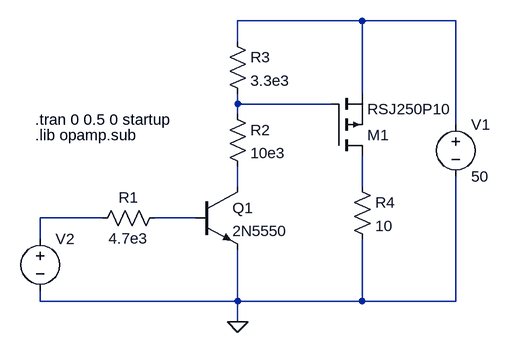
[diagram p0: schematic pmos-driver.asc]
pmos-driver.asc, the LTspice schematic file:
Version 4
SHEET 1 2184 680
WIRE -208 -688 -400 -688
WIRE -64 -688 -208 -688
WIRE -400 -656 -400 -688
WIRE -208 -576 -208 -688
WIRE -400 -560 -400 -576
WIRE -256 -560 -400 -560
WIRE -400 -544 -400 -560
WIRE -64 -528 -64 -688
WIRE -400 -432 -400 -464
WIRE -208 -432 -208 -480
WIRE -608 -384 -704 -384
WIRE -464 -384 -528 -384
WIRE -704 -352 -704 -384
WIRE -704 -256 -704 -272
WIRE -400 -256 -400 -336
WIRE -400 -256 -704 -256
WIRE -208 -256 -208 -352
WIRE -208 -256 -400 -256
WIRE -64 -256 -64 -448
WIRE -64 -256 -208 -256
WIRE -400 -224 -400 -256
FLAG -400 -224 0
SYMBOL pmos -256 -480 M180
SYMATTR InstName M1
SYMATTR Value RSJ250P10
SYMBOL res -512 -400 R90
WINDOW 0 0 56 VBottom 2
WINDOW 3 32 56 VTop 2
SYMATTR InstName R1
SYMATTR Value 4.7e3
SYMBOL npn -464 -432 R0
SYMATTR InstName Q1
SYMATTR Value 2N5550
SYMBOL res -416 -560 R0
SYMATTR InstName R2
SYMATTR Value 10e3
SYMBOL res -416 -672 R0
SYMATTR InstName R3
SYMATTR Value 3.3e3
SYMBOL res -224 -448 R0
SYMATTR InstName R4
SYMATTR Value 10
SYMBOL voltage -64 -544 R0
WINDOW 123 0 0 Left 0
WINDOW 39 0 0 Left 0
SYMATTR InstName V1
SYMATTR Value 50
SYMBOL voltage -704 -368 R0
WINDOW 3 24 96 Invisible 2
WINDOW 123 0 0 Left 0
WINDOW 39 0 0 Left 0
SYMATTR Value PULSE(0 3.3 0 10e-9 10e-9 0.1 0.2)
SYMATTR InstName V2
TEXT -712 -536 Left 2 !.tran 0 0.5 0 startup
TEXT -712 -512 Left 2 !.lib opamp.sub

The netlist it stands for:
* pmos-driver.asc
M1 N004 N002 N001 N001 RSJ250P10
R1 N006 N005 4.7e3
Q1 N003 N006 0 0 2N5550
R2 N002 N003 10e3
R3 N001 N002 3.3e3
R4 N004 0 10
V1 N001 0 50
V2 N005 0 PULSE(0 3.3 0 10e-9 10e-9 0.1 0.2)
.model NPN NPN
.model PNP PNP
.lib standard.bjt
.model NMOS NMOS
.model PMOS PMOS
.lib standard.mos
.tran 0 0.5 0 startup
.lib opamp.sub
.backanno
.end